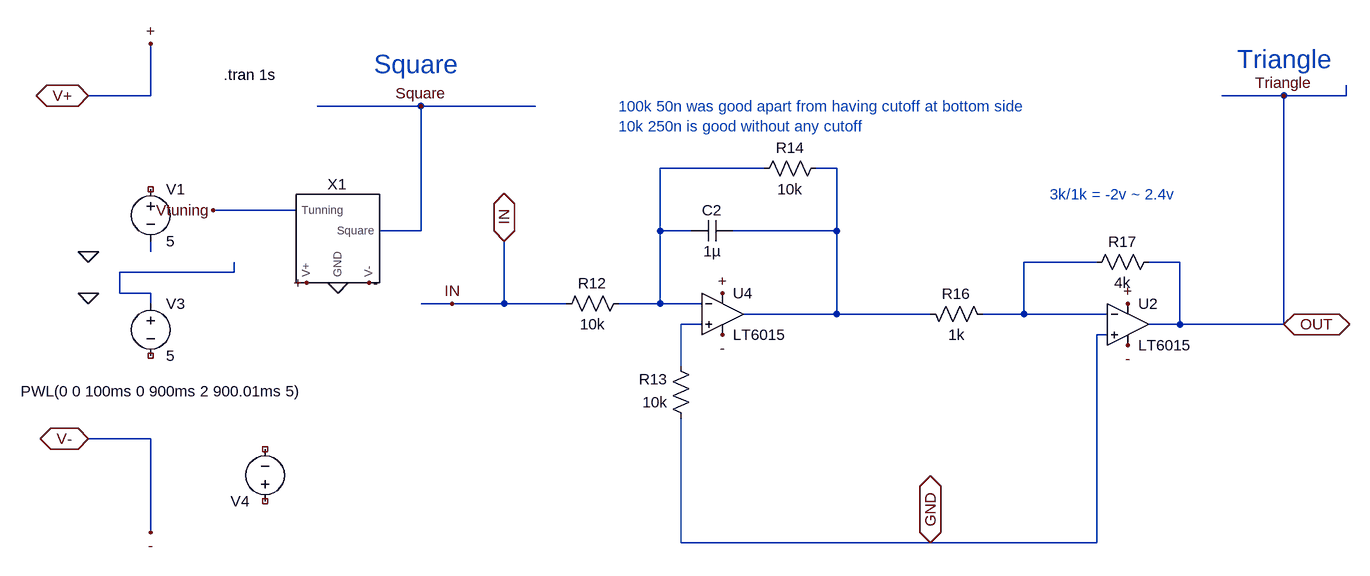
[diagram p0: schematic Square_to_Triangle_Converter.asc]
Square_to_Triangle_Converter.asc, the LTspice schematic file:
Version 4
SHEET 1 6980 1532
WIRE 1712 16 1712 -64
WIRE 1712 16 1616 16
WIRE 3456 16 3360 16
WIRE 3552 16 3552 0
WIRE 3552 16 3456 16
WIRE 2128 32 1968 32
WIRE 2304 32 2128 32
WIRE 2656 128 2496 128
WIRE 2768 128 2736 128
WIRE 1936 192 1808 192
WIRE 2128 224 2128 32
WIRE 2128 224 2064 224
WIRE 2496 224 2496 128
WIRE 2544 224 2496 224
WIRE 2768 224 2768 128
WIRE 2768 224 2608 224
WIRE 1712 256 1712 240
WIRE 3168 272 3056 272
WIRE 3296 272 3248 272
WIRE 1840 288 1840 272
WIRE 1840 288 1664 288
WIRE 1664 320 1664 288
WIRE 1712 320 1664 320
WIRE 1712 336 1712 320
WIRE 2176 336 2128 336
WIRE 2256 336 2256 240
WIRE 2256 336 2176 336
WIRE 2352 336 2256 336
WIRE 2496 336 2496 224
WIRE 2496 336 2432 336
WIRE 2560 336 2496 336
WIRE 2768 352 2768 224
WIRE 2768 352 2624 352
WIRE 2912 352 2768 352
WIRE 3056 352 3056 272
WIRE 3056 352 2992 352
WIRE 3184 352 3056 352
WIRE 2560 368 2528 368
WIRE 3296 368 3296 272
WIRE 3296 368 3248 368
WIRE 3456 368 3456 16
WIRE 3456 368 3296 368
WIRE 3184 384 3168 384
WIRE 2528 432 2528 368
WIRE 1712 544 1616 544
WIRE 1712 688 1712 544
WIRE 2528 704 2528 512
WIRE 2912 704 2528 704
WIRE 3168 704 3168 384
WIRE 3168 704 2912 704
FLAG 1712 -64 +
FLAG 1712 688 -
FLAG 1808 192 Vtuning
FLAG 1616 256 0
FLAG 1616 320 0
FLAG 2128 32 Square
FLAG 3456 16 Triangle
FLAG 3216 336 +
FLAG 3216 400 -
FLAG 2592 320 +
FLAG 2592 384 -
FLAG 1952 304 +
FLAG 2048 304 -
FLAG 2000 304 0
FLAG 2256 240 IN
IOPIN 2256 240 BiDir
FLAG 3456 368 OUT
IOPIN 3456 368 BiDir
FLAG 2912 704 GND
IOPIN 2912 704 BiDir
FLAG 1616 16 V+
IOPIN 1616 16 BiDir
FLAG 1616 544 V-
IOPIN 1616 544 BiDir
FLAG 2176 336 IN
SYMBOL voltage 1712 144 R0
WINDOW 123 0 0 Left 0
WINDOW 39 0 0 Left 0
SYMATTR InstName V1
SYMATTR Value 5
SYMBOL voltage 1712 320 R0
WINDOW 123 0 0 Left 0
WINDOW 39 0 0 Left 0
SYMATTR InstName V3
SYMATTR Value 5
SYMBOL res 2448 320 R90
WINDOW 0 0 56 VBottom 2
WINDOW 3 32 56 VTop 2
SYMATTR InstName R12
SYMATTR Value 10k
SYMBOL res 2544 528 R180
WINDOW 0 36 76 Left 2
WINDOW 3 36 40 Left 2
SYMATTR InstName R13
SYMATTR Value 10k
SYMBOL cap 2608 208 R90
WINDOW 0 0 32 VBottom 2
WINDOW 3 32 32 VTop 2
SYMATTR InstName C2
SYMATTR Value 1µ
SYMBOL res 2752 112 R90
WINDOW 0 0 56 VBottom 2
WINDOW 3 32 56 VTop 2
SYMATTR InstName R14
SYMATTR Value 10k
SYMBOL res 3008 368 M270
WINDOW 0 32 56 VTop 2
WINDOW 3 0 56 VBottom 2
SYMATTR InstName R16
SYMATTR Value 1k
SYMBOL res 3264 256 R90
WINDOW 0 0 56 VBottom 2
WINDOW 3 32 56 VTop 2
SYMATTR InstName R17
SYMATTR Value 4k
SYMBOL Opamps\\LT6015 3216 368 R0
SYMATTR InstName U2
SYMBOL Opamps\\LT6015 2592 352 R0
SYMATTR InstName U4
SYMBOL Square_VCO 2000 256 R0
SYMATTR InstName X1
SYMBOL voltage 1888 656 R180
WINDOW 3 -59 185 Left 2
WINDOW 123 0 0 Left 0
WINDOW 39 0 0 Left 0
SYMATTR Value PWL(0 0 100ms 0 900ms 2 900.01ms 5)
SYMATTR InstName V4
TEXT 1824 -16 Left 2 !.tran 1s
TEXT 2432 32 Left 2 ;100k 50n was good apart from having cutoff at bottom side\n10k 250n is good without any cutoff
TEXT 3096 168 Left 2 ;3k/1k = -2v ~ 2.4v
TEXT 3384 -40 Left 4 ;Triangle
TEXT 2056 -32 Left 4 ;Square

The netlist it stands for:
* Square_to_Triangle_Converter.asc
V1 NC_01 N003 5
V3 N005 NC_02 5
R12 N001 IN 10k
R13 GND N006 10k
C2 N002 N001 1µ
R14 N002 N001 10k
R16 N004 N002 1k
R17 OUT N004 4k
XU2 GND N004 V+ V- OUT LT6016  ; LT6015, pins In+ In- V+ V- OUT
XU4 N006 N001 V+ V- N002 LT6016  ; LT6015, pins In+ In- V+ V- OUT
XX1 0 Square Vtuning V+ V- Square_VCO  ; pins GND Square Tunning V+ V-
V4 NC_03 NC_04 PWL(0 0 100ms 0 900ms 2 900.01ms 5)
.tran 1s
* 100k 50n was good apart from having cutoff at bottom side
* 10k 250n is good without any cutoff
* 3k/1k = -2v ~ 2.4v
* Triangle
* Square
.lib LTC2.lib
.backanno
.end